# Altium schematic sheet coenv_SCH.SchDoc
size A4
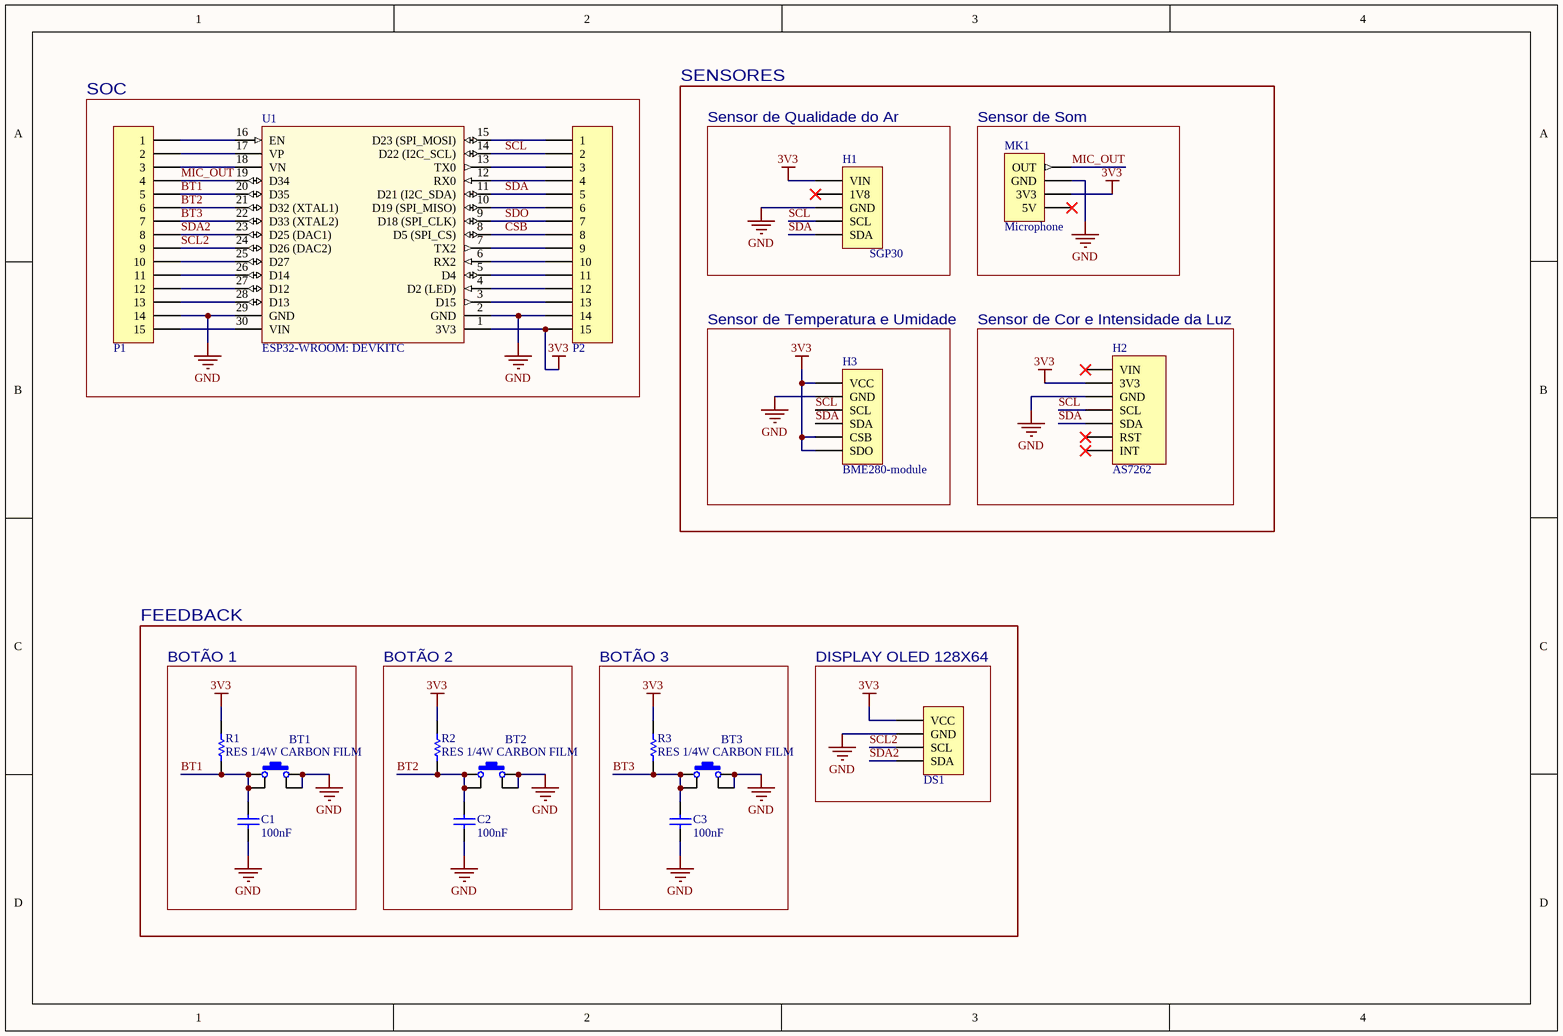
[diagram p0: coenv_SCH.SchDoc]

## Parts
BT1  SPST  [TACT SWITCH PHT]  (value not drawn)
BT2  SPST  [TACT SWITCH PHT]  (value not drawn)
BT3  SPST  [TACT SWITCH PHT]  (value not drawn)
C1  value 100nF  [CAP CER DISK 100NF 50V]  (hidden comment: VJ0603Y104JXJPW1BC)
C2  value 100nF  [CAP CER DISK 100NF 50V]  (hidden comment: VJ0603Y104JXJPW1BC)
C3  value 100nF  [CAP CER DISK 100NF 50V]  (hidden comment: VJ0603Y104JXJPW1BC)
DS1  Display OLED  [OLED 128x64 - offset]  (value not drawn)
H1  SGP30  [SGP30 1x5]
H2  AS7262  [AS7262]
H3  BME280-module  [BME280 1x6]
MK1  Microphone  [microphone module max4466]
P1  Header 15  [HDR FEMALE 1x15]  (value not drawn)
P2  Header 15  [HDR FEMALE 1x15]  (value not drawn)
R1  RES 1/4W CARBON FILM  [RES 10K 1/4W CARBON FILM]
R2  RES 1/4W CARBON FILM  [RES 10K 1/4W CARBON FILM]
R3  RES 1/4W CARBON FILM  [RES 10K 1/4W CARBON FILM_STAND]
U1  ESP32-WROOM: DEVKITC  [ESP32-WROOM-devkit]  (hidden comment: ESP32-DEVKITC)

## Blocks framed on the sheet
SOC: P1 P2 U1
Sensor de Qualidade do Ar: H1
Sensor de Som: MK1
Sensor de Temperatura e Umidade: H3
Sensor de Cor e Intensidade da Luz: H2
BOTÃO 1: BT1 C1 R1
BOTÃO 2: BT2 C2 R2
BOTÃO 3: BT3 C3 R3
DISPLAY OLED 128X64: DS1

## Nets
3V3: DS1.1(VCC) H1.1(VIN) H2.2(3V3) H3.1(VCC) H3.5(CSB) H3.6(SDO) MK1.2(3V3) P2.15 R1.2 R2.2 R3.2 U1.1(3V3)
GND: BT1.3 BT1.4 BT2.3 BT2.4 BT3.3 BT3.4 C1.1 C2.1 C3.1 DS1.2(GND) H1.3(GND) H2.3(GND) H3.2(GND) MK1.3(GND) P1.14 P2.14 U1.2(GND) U1.29(GND)
BT1: BT1.1 BT1.2 C1.2 P1.5 R1.1 U1.20(D35)
BT2: BT2.1 BT2.2 C2.2 P1.6 R2.1 U1.21(D32_(XTAL1))
BT3: BT3.1 BT3.2 C3.2 P1.7 R3.1 U1.22(D33_(XTAL2))
CSB: P2.8 U1.8(D5_(SPI_CS))
MIC_OUT: MK1.4(OUT) P1.4 U1.19(D34)
SCL: H1.4(SCL) H2.4(SCL) H3.3(SCL) P2.2 U1.14(D22_(I2C_SCL))
SCL2: DS1.3(SCL) P1.9 U1.24(D26_(DAC2))
SDA: H1.5(SDA) H2.5(SDA) H3.4(SDA) P2.5 U1.11(D21_(I2C_SDA))
SDA2: DS1.4(SDA) P1.8 U1.23(D25_(DAC1))
SDO: P2.7 U1.9(D18_(SPI_CLK))
NetP1_1: P1.1 U1.16(EN)
NetP1_2: P1.2 U1.17(VP)
NetP1_3: P1.3 U1.18(VN)
NetP1_10: P1.10 U1.25(D27)
NetP1_11: P1.11 U1.26(D14)
NetP1_12: P1.12 U1.27(D12)
NetP1_13: P1.13 U1.28(D13)
NetP1_15: P1.15 U1.30(VIN)
NetP2_1: P2.1 U1.15(D23_(SPI_MOSI))
NetP2_3: P2.3 U1.13(TX0)
NetP2_4: P2.4 U1.12(RX0)
NetP2_6: P2.6 U1.10(D19_(SPI_MISO))
NetP2_9: P2.9 U1.7(TX2)
NetP2_10: P2.10 U1.6(RX2)
NetP2_11: P2.11 U1.5(D4)
NetP2_12: P2.12 U1.4(D2_(LED))
NetP2_13: P2.13 U1.3(D15)

Not connected (* = marked no-connect by the designer): H1 2(1V8)*; H2 1(VIN)* 6(RST)* 7(INT)*; MK1 1(5V)*

## Notes on the sheet
- SENSORES
- FEEDBACK

## Library data of the parts
BT1-BT3 = SWITCH TACTILE SPST-NO 0.05A 24V: Manufacturer: TE Connectivity ALCOSWITCH Switches; Manufacturer Part Number: FSM2JSMAA; Switch Function: Off-Mom; Contact Rating @ Voltage: 0.05A @ 24VDC; Actuator Type: Standard; Actuator Height off PCB, from Pins: 4.30mm; Actuator Orientation: Top Actuated; Outline: 6.00mm x 6.00mm; Illumination: Non-Illuminated; Operating Force: 260gf; Actuator Material: Polyamide (PA), Nylon; Switch Travel: 0.25mm; Mechanical Life: 100,000 Cycles; Supplier 1: Digi-Key; RoHS: RoHS Compliant; Category: Switches; Stock 1: 1989; Pricing 1: 1=0.16, 10=0.159, 25=0.1532, 50=0.1476, 100=0.1394, 250=0.1312, 500=0.12574, 1000=0.09568 (USD); Packaging: Bulk; Part Status: Active; Circuit: SPST-NO; Mounting Type: Surface Mount; Termination Style: Gull Wing; Illumination Voltage (Nominal): -; Illumination Type, Color: -; Ingress Protection: -; Features: -; Operating Temperature: -35°C ~ 85°C; ComponentLink1URL: http://www.te.com/commerce/DocumentDelivery/DDEController?Action=srchrtrv&DocNm=2-1437565-7&DocType=Customer+Drawing&DocLang=English; ComponentLink1Description: http://www.te.com/commerce/DocumentDelivery/DDEController?Action=srchrtrv&DocNm=2-1437565-7&DocType=Customer+Drawing&DocLang=English; Supplier Part Number 1: FSM2JSMAA-ND
C1-C3 = CAP CER 0.1UF 16V 5% 0603: Multilayer Ceramic Capacitors MLCC - SMD/SMT 0603 0.1uF 16volts X7R 5%; Manufacturer: Vishay / Vitramon; Type: Ultra Small Commodity MLCCs; Voltage Rating DC: 16 V; Case Height: 0.95 mm; Case Length: 1.6 mm; Case Width: 0.8 mm; Dissipation Factor DF: 3.5; Temperature Coefficient / Code: +/- 15 %; Supplier 1: Mouser; Manufacturer Part Number: VJ0603Y104JXJPW1BC; RoHS: RoHS Compliant; Category: Multilayer Ceramic Capacitors MLCC - SMD/SMT; Stock 1: 111624; Pricing 1: 1=0.089, 50=0.036, 100=0.028, 500=0.025, 1000=0.022, 15000=0.018, 75000=0.016 (AUD); Capacitance: 0.1 uF; Operating Temperature Range: - 55 C to + 125 C; Package / Case: 0603 (1608 metric); Packaging: Reel; Product: General Type MLCCs; Series: VJ W1BC; Termination Style: SMD/SMT; Tolerance: 5 %; Voltage Rating AC: -; Brand: Vishay / Vitramon; Case Code - in: 0603; Case Code - mm: 1608; Dielectric: X7R; Maximum Operating Temperature: + 125 C; Minimum Operating Temperature: - 55 C; Product Category: Ceramic Chip Capacitors; Standard Pack Qty: 15000; RoHS - Mouser: Y; Minimum Order Quantity: 1; Reeling: True; ComponentLink1URL: http://www.mouser.com/ds/2/427/vjw1bcbascomseries-223529.pdf; ComponentLink1Description: http://www.mouser.com/ds/2/427/vjw1bcbascomseries-223529.pdf; Supplier Part Number 1: 77-VJ0603Y104JXJPBC
DS1 = Display OLED: MONOCHROME 1.3 128X64; Manufacturer: Adafruit Industries; Manufacturer Part Number: 938; Resolution (height): 64pixel; Resolution (width): 128pixel; Interface: I2C; Background Color: Black; Diagonal Size: 0.96inch; Supplier 1: Mouser; RoHS: Yes; Category: LCD, OLED, Graphic Displays; Pricing 1: 1=19,95000, 10=19,95000 (USD); ComponentLink1URL: https://learn.adafruit.com/downloads/pdf/monochrome-oled-breakouts.pdf?src-supplier=Digi-Key; ComponentLink1Description: https://learn.adafruit.com/downloads/pdf/monochrome-oled-breakouts.pdf?src-supplier=Digi-Key; Supplier Part Number 1: 485-938
H1 = SGP30: SGP30 AIR QUALITY SENSOR BREAKOU; Manufacturer: Adafruit Industries; Manufacturer Part Number: 3709; Interface: I2C; Supplier 1: Digi-Key; RoHS: No; Stock 1: 89; Pricing 1: 1=19,95000 (USD); ComponentLink1URL: https://cdn-learn.adafruit.com/downloads/pdf/adafruit-sgp30-gas-tvoc-eco2-mox-sensor.pdf?src-supplier=Digi-Key; ComponentLink1Description: https://cdn-learn.adafruit.com/downloads/pdf/adafruit-sgp30-gas-tvoc-eco2-mox-sensor.pdf?src-supplier=Digi-Key; Supplier Part Number 1: 1528-2531-ND
H2 = AS7262: Adafruit AS7262 6-Channel Visible Light / Color Sensor Breakout; Manufacturer: Adafruit Industries; Manufacturer Part Number: 3779; Supplier 1: Digi-Key; RoHS: No; Stock 1: 90; Pricing 1: 1=19,95000 (USD); Supplier Part Number 1: 1528-2575-ND
H3 = BME280-module: SENSOR HUM/PRESS I2C/SPI BME280; Manufacturer: Adafruit Industries; Manufacturer Part Number: 2652; Sensor Type: Temperature; Interface: I2C,SPI; Evaluation Kit: Yes; BME280: 485-2652; Supplier 1: Mouser; RoHS: Yes; Stock 1: 267; Pricing 1: 1=19,95000, 10=19,95000 (USD); Package Quantity: 1; ComponentLink1URL: http://www.mouser.com/ds/2/737/adafruit-bme280-humidity-barometric-pressure-tempe-740823.pdf?src-supplier=Mouser; ComponentLink1Description: http://www.mouser.com/ds/2/737/adafruit-bme280-humidity-barometric-pressure-tempe-740823.pdf?src-supplier=Mouser; ComponentLink2URL: https://learn.adafruit.com/downloads/pdf/adafruit-bme280-humidity-barometric-pressure-temperature-sensor-breakout.pdf?src-supplier=Digi-Key; ComponentLink2Description: https://learn.adafruit.com/downloads/pdf/adafruit-bme280-humidity-barometric-pressure-temperature-sensor-breakout.pdf?src-supplier=Digi-Key
MK1 = Microphone: Accessory Type:Electret Microphone; For Use With:MCU & Sensor Evaluation & Development Boards; Features:20-20kHz Electret Microphone, Adjustable Gain, Excellent Power Supply Noise Rejection ;RoHS Compliant: Yes; Manufacturer: Adafruit Industries; Manufacturer Part Number: 1063; Supplier 1: Digi-Key; RoHS: Yes; Category: Integrated Circuits (ICs); Stock 1: 517; Pricing 1: 1=6,95000 (USD); Evaluation Kit: Yes; REACH SVHC: Unknown; ComponentLink1URL: https://datasheet.ciiva.com/46423/1815587-46423253.pdf?src-supplier=Element14; ComponentLink1Description: https://datasheet.ciiva.com/46423/1815587-46423253.pdf?src-supplier=Element14; Supplier Part Number 1: 1528-1013-ND
P1 P2 = Header 15: Header, 15-Pin; LatestRevisionDate: 17-Jul-2002; LatestRevisionNote: Re-released for DXP Platform.; Publisher: Altium Limited
R1-R3 = RES 1/4W CARBON FILM: RES ? OHM 1/4W 5% CARBON FILM; Manufacturer: Ty-Ohm; Manufacturer Part Number: CR25; Power (Watts): 0.25W, 1/4W; Temperature Coefficient: 0/ -500ppm/°C; Supplier 1: Mult Comercial; RoHS: RoHS Compliant; Category: Resistors; Stock 1: 617543; Pricing 1: 1=0.20 (BRL); Packaging: Cut Tape (CT); Tolerance: ±5%; Composition: Carbon Film; Features: Flame Retardant Coating, Safety; Operating Temperature: -55°C ~ 155°C; Package / Case: Axial; Supplier Device Package: Axial; Size / Dimension: 0.091" Dia x 0.256" L (2.30mm x 6.50mm); Height: -; Number of Terminations: 2; ComponentLink1URL: http://loja.multcomercial.com.br/resistor-de-1-4-de-watt-cr25-5-de-tolerancia.html; ComponentLink1Description: http://loja.multcomercial.com.br/resistor-de-1-4-de-watt-cr25-5-de-tolerancia.html; Supplier Part Number 1: Resistor de Filme de Carbono 1/4 de Watt CR25 5% de tolerância - 0.22R Ω à 10M Ω; Resistance (Ohms): ?
U1 = ESP32-DEVKITC: EVAL BOARD FOR ESP-WROOM-32; Manufacturer: Espressif Systems; Frequency: 2.4GHz; Supplier 1: Digi-Key; Manufacturer Part Number: ESP32-DEVKITC; RoHS: No; Category: RF Semiconductors and Devices; Pricing 1: 1=0,00000 (USD); ComponentLink1URL: https://www.espressif.com/sites/default/files/documentation/esp32-wroom-32_datasheet_en.pdf?src-supplier=Digi-Key; ComponentLink1Description: https://www.espressif.com/sites/default/files/documentation/esp32-wroom-32_datasheet_en.pdf?src-supplier=Digi-Key